# Altium schematic sheet Mechanical.SchDoc
size A3; SheetNumber: 14; SheetTotal: 15
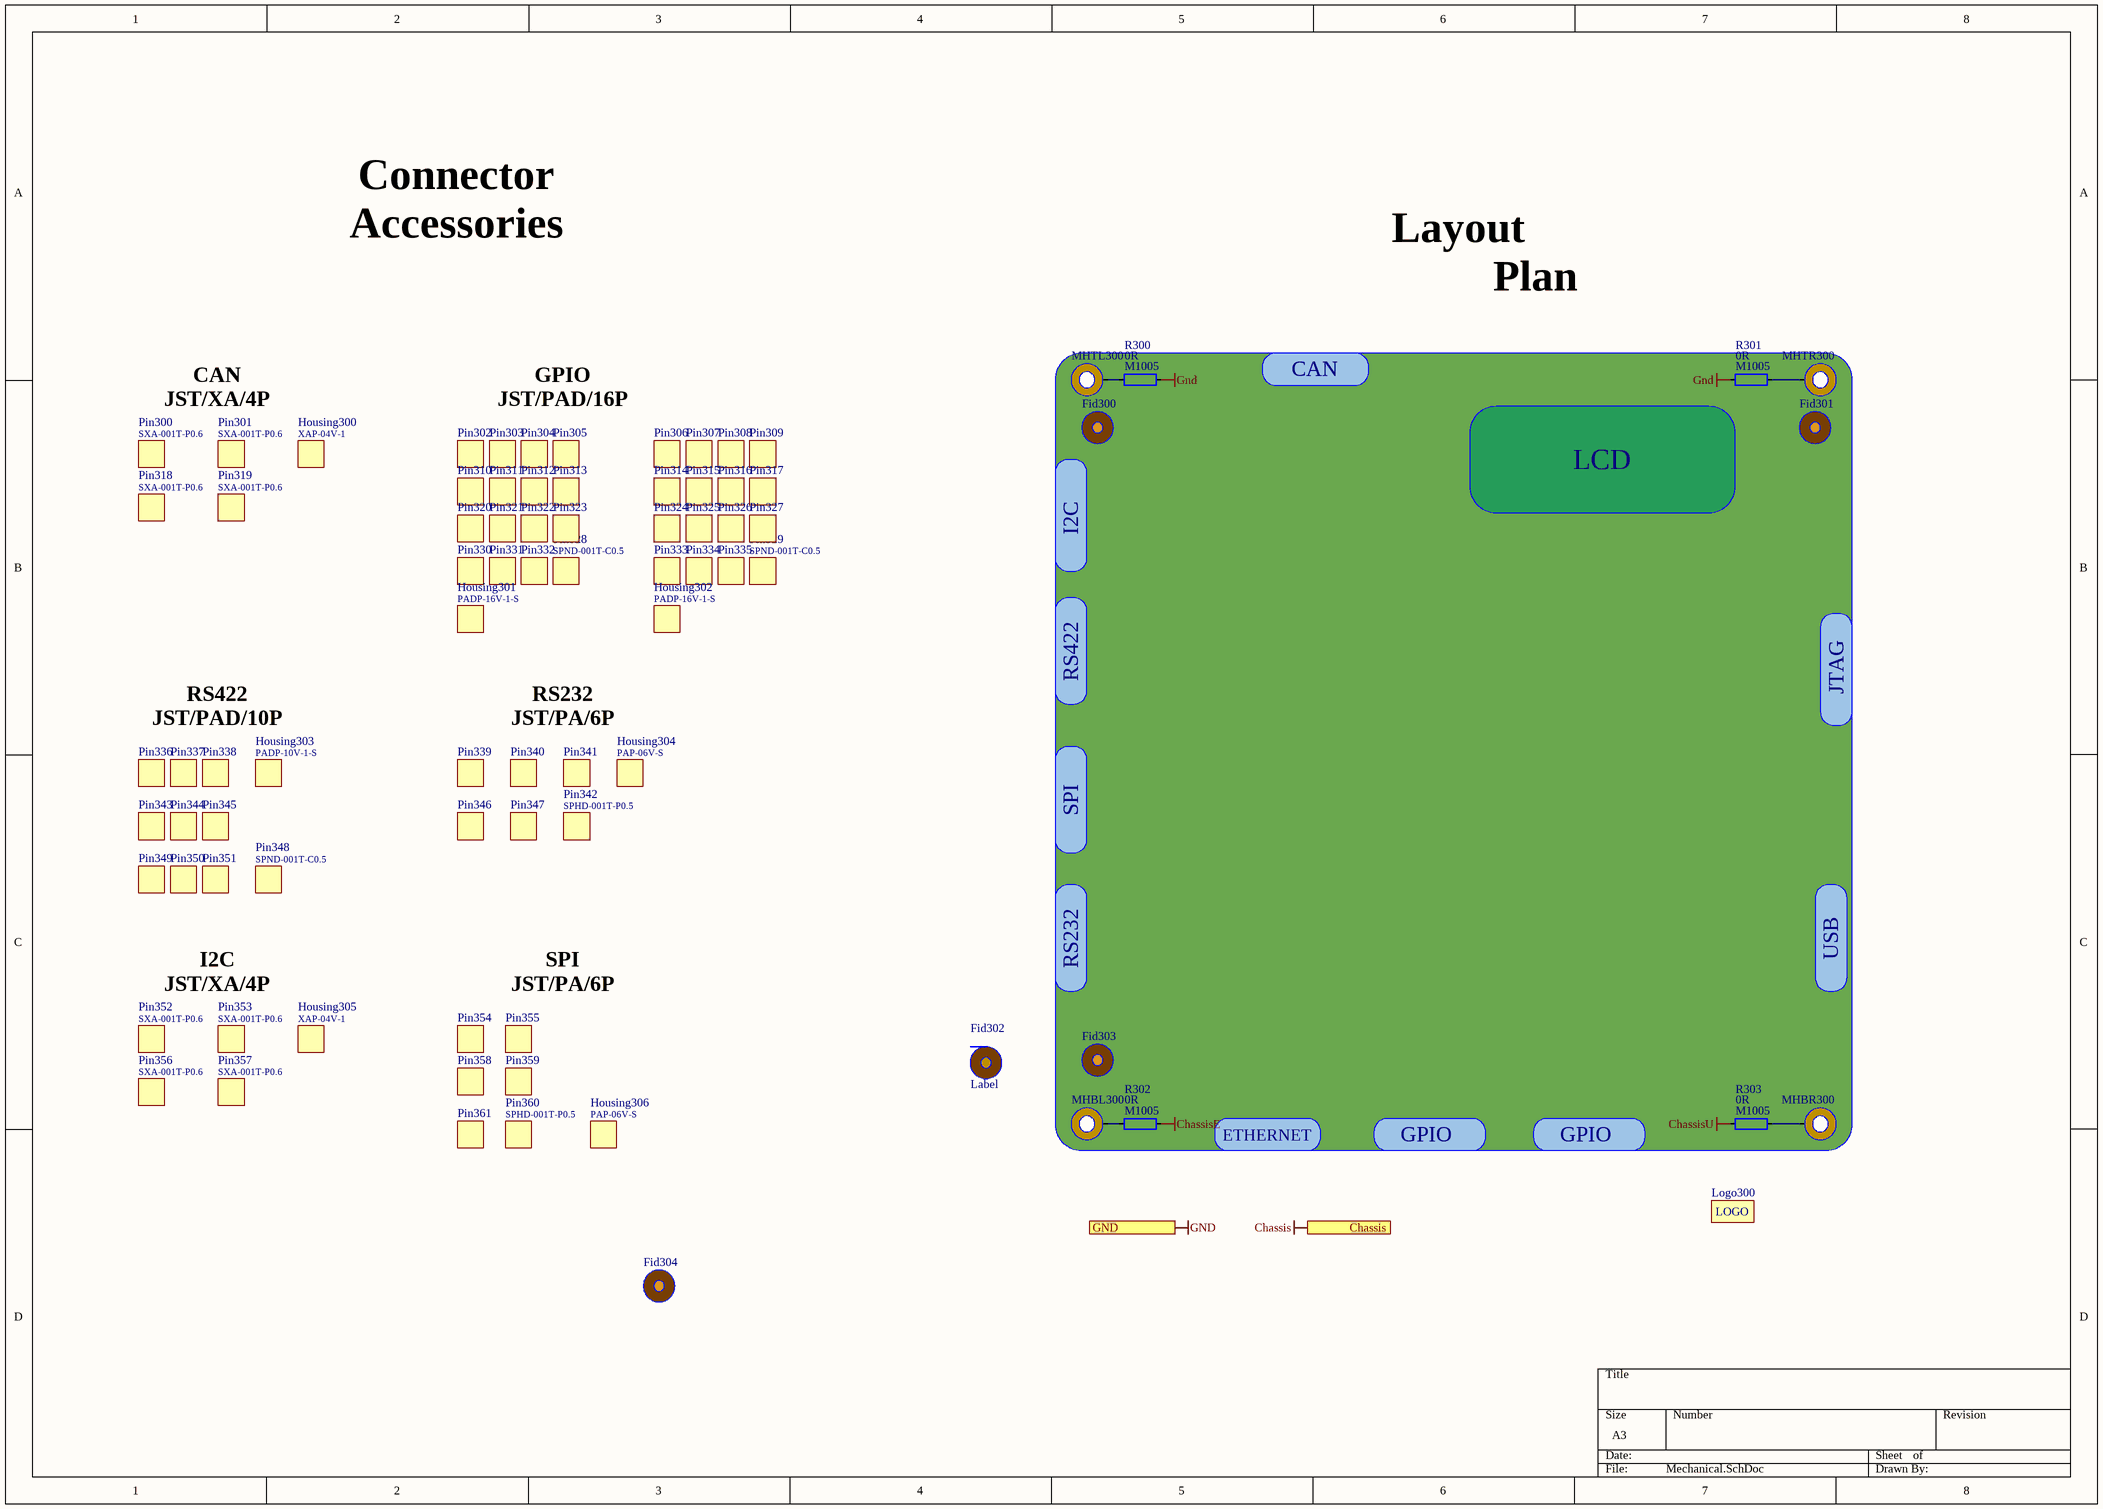
[diagram p0: Mechanical.SchDoc]

## Parts
Fid300  Fiducial  [Fiducial - 2mm, 5mm]  (value not drawn)  (no BOM)
Fid301  Fiducial  [Fiducial - 2mm, 5mm]  (value not drawn)  (no BOM)
Fid302  Fiducial  [Fiducial-2mm,5mm]  (value not drawn)
Fid303  Fiducial  [Fiducial - 2mm, 5mm]  (value not drawn)  (no BOM)
Fid304  Fiducial  [Fiducial - 2mm, 5mm]  (value not drawn)  (no BOM)
Housing300  Manufacturer Part Number: XAP-04V-1  [Housing, PAP-06V-S]  (hidden comment: Housing)
Housing301  Manufacturer Part Number: PADP-16V-1-S  [Housing, PADP-16V-1-S]  (hidden comment: Housing)
Housing302  Manufacturer Part Number: PADP-16V-1-S  [Housing, PADP-16V-1-S]  (hidden comment: Housing)
Housing303  Manufacturer Part Number: PADP-10V-1-S  [Housing, PADP-10V-1-S]  (hidden comment: Housing)
Housing304  Manufacturer Part Number: PAP-06V-S  [Housing, PAP-06V-S]  (hidden comment: Housing)
Housing305  Manufacturer Part Number: XAP-04V-1  [Housing, PAP-06V-S]  (hidden comment: Housing)
Housing306  Manufacturer Part Number: PAP-06V-S  [Housing, PAP-06V-S]  (hidden comment: Housing)
Logo300  Logo  [Logo 1]  (value not drawn)  (no BOM)
MHBL300  Mounting Hole  [Mounting Hole - Hole-3.2mm, Pad-5mm]  (value not drawn)  (no BOM)
MHBR300  Mounting Hole  [Mounting Hole - Hole-3.2mm, Pad-5mm]  (value not drawn)  (no BOM)
MHTL300  Mounting Hole  [Mounting Hole - Hole-3.2mm, Pad-5mm]  (value not drawn)  (no BOM)
MHTR300  Mounting Hole  [Mounting Hole - Hole-3.2mm, Pad-5mm]  (value not drawn)  (no BOM)
Pin300  Manufacturer Part Number: SXA-001T-P0.6  [Pin, SPHD-001T-P0.5]  (hidden comment: Pin)
Pin301  Manufacturer Part Number: SXA-001T-P0.6  [Pin, SPHD-001T-P0.5]  (hidden comment: Pin)
Pin302  Pin  [Pin, SPND-001T-C0.5]  (value not drawn)
Pin303  Pin  [Pin, SPND-001T-C0.5]  (value not drawn)
Pin304  Pin  [Pin, SPND-001T-C0.5]  (value not drawn)
Pin305  Pin  [Pin, SPND-001T-C0.5]  (value not drawn)
Pin306  Pin  [Pin, SPND-001T-C0.5]  (value not drawn)
Pin307  Pin  [Pin, SPND-001T-C0.5]  (value not drawn)
Pin308  Pin  [Pin, SPND-001T-C0.5]  (value not drawn)
Pin309  Pin  [Pin, SPND-001T-C0.5]  (value not drawn)
Pin310  Pin  [Pin, SPND-001T-C0.5]  (value not drawn)
Pin311  Pin  [Pin, SPND-001T-C0.5]  (value not drawn)
Pin312  Pin  [Pin, SPND-001T-C0.5]  (value not drawn)
Pin313  Pin  [Pin, SPND-001T-C0.5]  (value not drawn)
Pin314  Pin  [Pin, SPND-001T-C0.5]  (value not drawn)
Pin315  Pin  [Pin, SPND-001T-C0.5]  (value not drawn)
Pin316  Pin  [Pin, SPND-001T-C0.5]  (value not drawn)
Pin317  Pin  [Pin, SPND-001T-C0.5]  (value not drawn)
Pin318  Manufacturer Part Number: SXA-001T-P0.6  [Pin, SPHD-001T-P0.5]  (hidden comment: Pin)
Pin319  Manufacturer Part Number: SXA-001T-P0.6  [Pin, SPHD-001T-P0.5]  (hidden comment: Pin)
Pin320  Pin  [Pin, SPND-001T-C0.5]  (value not drawn)
Pin321  Pin  [Pin, SPND-001T-C0.5]  (value not drawn)
Pin322  Pin  [Pin, SPND-001T-C0.5]  (value not drawn)
Pin323  Pin  [Pin, SPND-001T-C0.5]  (value not drawn)
Pin324  Pin  [Pin, SPND-001T-C0.5]  (value not drawn)
Pin325  Pin  [Pin, SPND-001T-C0.5]  (value not drawn)
Pin326  Pin  [Pin, SPND-001T-C0.5]  (value not drawn)
Pin327  Pin  [Pin, SPND-001T-C0.5]  (value not drawn)
Pin328  Manufacturer Part Number: SPND-001T-C0.5  [Pin, SPND-001T-C0.5]  (hidden comment: Pin)
Pin329  Manufacturer Part Number: SPND-001T-C0.5  [Pin, SPND-001T-C0.5]  (hidden comment: Pin)
Pin330  Pin  [Pin, SPND-001T-C0.5]  (value not drawn)
Pin331  Pin  [Pin, SPND-001T-C0.5]  (value not drawn)
Pin332  Pin  [Pin, SPND-001T-C0.5]  (value not drawn)
Pin333  Pin  [Pin, SPND-001T-C0.5]  (value not drawn)
Pin334  Pin  [Pin, SPND-001T-C0.5]  (value not drawn)
Pin335  Pin  [Pin, SPND-001T-C0.5]  (value not drawn)
Pin336  Pin  [Pin, SPND-001T-C0.5]  (value not drawn)
Pin337  Pin  [Pin, SPND-001T-C0.5]  (value not drawn)
Pin338  Pin  [Pin, SPND-001T-C0.5]  (value not drawn)
Pin339  Pin  [Pin, SPHD-001T-P0.5]  (value not drawn)
Pin340  Pin  [Pin, SPHD-001T-P0.5]  (value not drawn)
Pin341  Pin  [Pin, SPHD-001T-P0.5]  (value not drawn)
Pin342  Manufacturer Part Number: SPHD-001T-P0.5  [Pin, SPHD-001T-P0.5]  (hidden comment: Pin)
Pin343  Pin  [Pin, SPND-001T-C0.5]  (value not drawn)
Pin344  Pin  [Pin, SPND-001T-C0.5]  (value not drawn)
Pin345  Pin  [Pin, SPND-001T-C0.5]  (value not drawn)
Pin346  Pin  [Pin, SPHD-001T-P0.5]  (value not drawn)
Pin347  Pin  [Pin, SPHD-001T-P0.5]  (value not drawn)
Pin348  Manufacturer Part Number: SPND-001T-C0.5  [Pin, SPND-001T-C0.5]  (hidden comment: Pin)
Pin349  Pin  [Pin, SPND-001T-C0.5]  (value not drawn)
Pin350  Pin  [Pin, SPND-001T-C0.5]  (value not drawn)
Pin351  Pin  [Pin, SPND-001T-C0.5]  (value not drawn)
Pin352  Manufacturer Part Number: SXA-001T-P0.6  [Pin, SPHD-001T-P0.5]  (hidden comment: Pin)
Pin353  Manufacturer Part Number: SXA-001T-P0.6  [Pin, SPHD-001T-P0.5]  (hidden comment: Pin)
Pin354  Pin  [Pin, SPHD-001T-P0.5]  (value not drawn)
Pin355  Pin  [Pin, SPHD-001T-P0.5]  (value not drawn)
Pin356  Manufacturer Part Number: SXA-001T-P0.6  [Pin, SPHD-001T-P0.5]  (hidden comment: Pin)
Pin357  Manufacturer Part Number: SXA-001T-P0.6  [Pin, SPHD-001T-P0.5]  (hidden comment: Pin)
Pin358  Pin  [Pin, SPHD-001T-P0.5]  (value not drawn)
Pin359  Pin  [Pin, SPHD-001T-P0.5]  (value not drawn)
Pin360  Manufacturer Part Number: SPHD-001T-P0.5  [Pin, SPHD-001T-P0.5]  (hidden comment: Pin)
Pin361  Pin  [Pin, SPHD-001T-P0.5]  (value not drawn)
R300  value 0R  Package: M1005  [Resistor_Smd_M1005_I0402]  (hidden comment: Resistor)
R301  value 0R  Package: M1005  [Resistor_Smd_M1005_I0402]  (hidden comment: Resistor)
R302  value 0R  Package: M1005  [Resistor_Smd_M1005_I0402]  (hidden comment: Resistor)
R303  value 0R  Package: M1005  [Resistor_Smd_M1005_I0402]  (hidden comment: Resistor)

## Blocks framed on the sheet
LCD: Fid300 Fid301 Fid303 MHBL300 MHBR300 MHTL300 MHTR300 R300-R303

## Ports
Chassis (out), GND (in)

## Nets
Chassis: port Chassis
ChassisE: R302.2
ChassisU: R303.1
GND: R300.2 R301.1 ; port GND
NetMHBL300_Hole: MHBL300.Hole R302.1
NetMHBR300_Hole: MHBR300.Hole R303.2
NetMHTL300_Hole: MHTL300.Hole R300.1
NetMHTR300_Hole: MHTR300.Hole R301.2

## Notes on the sheet
- Connector
  Accessories
- Layout
  Plan
- CAN
- CAN
  JST/XA/4P
- GPIO
  JST/PAD/16P
- I2C
- RS422
- JTAG
- RS422
  JST/PAD/10P
- RS232
  JST/PA/6P
- SPI
- RS232
- USB
- I2C
  JST/XA/4P
- SPI
  JST/PA/6P
- ETHERNET
- GPIO
- (in symbol Logo) LOGO

## Library data of the parts
Fid300 Fid301 Fid303 Fid304 = Fiducial: Mechanical, Fiducial, PCB, 2mm/5mm; Component Type: Fiducial; Component Category: Mechanical
Fid302 = Fiducial: IC,Interface,FTDI,QFN16; component category: capacitor*; ComponentLink1Description: datasheet; ComponentLink1URL: *; ComponentLink2Description: supplier link; ComponentLink2URL: *; component type: ceramic; supplier link: *; supplier currency: *; price,max: *; price,min: *; Quantity,max: *; Quantity,min: *; Operating Temparature,max: +85; Operating Temparature,min: -40; Supplier Part number: *; Supplier: Digikey; Manufacturer: FTDI; Package: Custom; Label: Label
Housing300 Housing305 = Housing: Housing, JST, 4P, XA; Component Category: Connector; ComponentLink1Description: Datasheet; ComponentLink1URL: E:\Altium\Datasheets\Connector - JST\XA Family.pdf; ComponentLink2Description: Supplier Link; ComponentLink2URL: https://www.digikey.com/en/products/detail/jst-sales-america-inc/XAP-04V-1/959010; Supplier: Digikey; Supplier Part Number: 455-2150-ND; Manufacturer: JST; Operating Temperature, Min: -25℃; Operating Temperature, Max: +85℃; Quantity, Min: 1; Quantity, Max: 2500; Price, Min: 0.16; Supplier Currency: $; Price, Max: 0.05958; Supplier Link: https://www.digikey.com/en/products/detail/jst-sales-america-inc/XAP-04V-1/959010; Component Type: Housing; Package: Housing
Housing301 Housing302 = Housing: Housing, JST, 16P, PAD; Component Category: Connector; ComponentLink1Description: Datasheet; ComponentLink1URL: E:\Altium\Datasheets\Connector - JST\PAD Family.pdf; ComponentLink2Description: Supplier Link; ComponentLink2URL: https://www.digikey.com/en/products/detail/jst-sales-america-inc/PADP-16V-1-S/1300224; Supplier: Digikey; Supplier Part Number: 455-2143-ND; Manufacturer: JST; Operating Temperature, Min: -25℃; Operating Temperature, Max: +85℃; Quantity, Min: 1; Quantity, Max: 2500; Price, Min: 0.35; Supplier Currency: $; Price, Max: 0.152; Supplier Link: https://www.digikey.com/en/products/detail/jst-sales-america-inc/PADP-16V-1-S/1300224?s=N4IgTCBcDaIAoEEAicC0BGAbANQyAugL5A; Component Type: PCB; Package: Housing
Housing303 = Housing: Housing, JST, 10P, PAD; Component Category: Connector; ComponentLink1Description: Datasheet; ComponentLink1URL: E:\Altium\Datasheets\Connector - JST\PAD Family.pdf; ComponentLink2Description: Supplier Link; ComponentLink2URL: https://www.digikey.com/en/products/detail/jst-sales-america-inc/PADP-10V-1-S/1300221; Supplier: Digikey; Supplier Part Number: 455-2140-ND; Manufacturer: JST; Operating Temperature, Min: -25℃; Operating Temperature, Max: +85℃; Quantity, Min: 1; Quantity, Max: 2500; Price, Min: 0.33; Supplier Currency: $; Price, Max: 0.14264; Supplier Link: https://www.digikey.com/en/products/detail/jst-sales-america-inc/PADP-10V-1-S/1300221; Component Type: PCB; Package: Housing
Housing304 = Housing: Housing, JST, PAP-06V-S; Component Category: Connector; ComponentLink1Description: Datasheet; ComponentLink1URL: E:\Altium\Datasheets\Connector - JST\PA Family.pdf; ComponentLink2Description: Supplier Link; ComponentLink2URL: https://www.digikey.com/en/products/detail/jst-sales-america-inc/PAP-06V-S/759978; Supplier: Digikey; Supplier Part Number: 455-1490-ND; Manufacturer: JST; Operating Temperature, Min: -25℃; Operating Temperature, Max: +85℃; Quantity, Min: 1; Quantity, Max: 2500; Price, Min: 0.19; Supplier Currency: $; Price, Max: 0.07808; Supplier Link: https://www.digikey.com/en/products/detail/jst-sales-america-inc/PAP-06V-S/759978; Component Type: PCB; Package: Housing
Housing306 = Housing: IC, Interface, FTDI, QFN-16; Manufacturer: JST; Component Category: Connector; ComponentLink1Description: Datasheet; ComponentLink1URL: E:\Altium\Datasheets\Connector - JST\PA Family.pdf; ComponentLink2Description: Supplier Link; ComponentLink2URL: https://www.digikey.com/en/products/detail/jst-sales-america-inc/PAP-06V-S/759978; Supplier: Digikey; Supplier Part Number: 455-1490-ND; Operating Temperature, Min: -25℃; Operating Temperature, Max: +85℃; Quantity, Min: 1; Quantity, Max: 2500; Price, Min: 0.19; Supplier Currency: $; Price, Max: 0.07808; Supplier Link: https://www.digikey.com/en/products/detail/jst-sales-america-inc/PAP-06V-S/759978; Component Type: PCB; Package: Housing
Logo300 = Logo: Mechanical, Logo; Component Type: Logo; Component Category: Mechanical
MHBL300 MHBR300 MHTL300 MHTR300 = Mounting Hole: Mechanical, Mounting Hole; Component Type: Mounting Hole; Component Category: Mechanical
Pin300 Pin301 Pin318 Pin319 Pin352 Pin353 Pin356 Pin357 = Pin: Pin, JST, SXA-001T-P0.6; Component Category: Connector; ComponentLink1Description: Datasheet; ComponentLink1URL: E:\Altium\Datasheets\Connector - JST\XA Family.pdf; ComponentLink2Description: Supplier Link; ComponentLink2URL: https://www.digikey.com/en/products/detail/jst-sales-america-inc/SXA-001T-P0-6/923775; Supplier: Digikey; Supplier Part Number: 455-1904-1-ND; Manufacturer: JST; Operating Temperature, Min: ---℃; Operating Temperature, Max: ---℃; Quantity, Min: 1; Quantity, Max: 56000; Price, Min: 0.1; Supplier Currency: $; Price, Max: 0.01303; Supplier Link: https://www.digikey.com/en/products/detail/jst-sales-america-inc/SXA-001T-P0-6/923775; Component Type: Pin; Package: Housing
Pin302-Pin317 Pin320-Pin338 Pin343-Pin345 Pin348-Pin351 = Pin: Pin, JST, SPND-001T-C0.5; Component Category: Connector; ComponentLink1Description: Datasheet; ComponentLink1URL: E:\Altium\Datasheets\Connector - JST\PAD Family.pdf; ComponentLink2Description: Supplier Link; ComponentLink2URL: https://www.digikey.com/en/products/detail/jst-sales-america-inc/SPND-001T-C0-5/1788519; Supplier: Digikey; Supplier Part Number: 455-2303-1-ND; Manufacturer: JST; Operating Temperature, Min: ---℃; Operating Temperature, Max: ---℃; Quantity, Min: 1; Quantity, Max: 56000; Price, Min: 0.1; Supplier Currency: $; Price, Max: 0.01409; Supplier Link: https://www.digikey.com/en/products/detail/jst-sales-america-inc/SPND-001T-C0-5/1788519; Component Type: PCB; Package: Housing
  Pin302-Pin317 Pin320-Pin327 Pin330-Pin338 Pin343-Pin345 Pin349-Pin351: Manufacturer Part Number: SPND-001T-C0.5
Pin339-Pin342 Pin346 Pin347 = Pin: Pin, JST, SPHD-001T-P0.5; Component Category: Connector; ComponentLink1Description: Datasheet; ComponentLink1URL: E:\Altium\Datasheets\Connector - JST\PA Family.pdf; ComponentLink2Description: Supplier Link; ComponentLink2URL: https://www.digikey.com/en/products/detail/jst-sales-america-inc/SPHD-001T-P0-5/608766; Supplier: Digikey; Supplier Part Number: 455-1325-1-ND; Manufacturer: JST; Operating Temperature, Min: *℃; Operating Temperature, Max: *℃; Quantity, Min: 1; Quantity, Max: 2500; Price, Min: 0.1; Supplier Currency: $; Price, Max: 0.01478; Supplier Link: https://www.digikey.com/en/products/detail/jst-sales-america-inc/SPHD-001T-P0-5/608766; Component Type: PCB; Package: Housing
  Pin339-Pin341 Pin346 Pin347: Manufacturer Part Number: SPHD-001T-P0.5
Pin354 Pin355 Pin358 Pin359 Pin361 = Pin: IC, Interface, FTDI, QFN-16; Manufacturer: JST; Manufacturer Part Number: SPHD-001T-P0.5; Component Category: Connector; ComponentLink1Description: Datasheet; ComponentLink1URL: E:\Altium\Datasheets\Connector - JST\PA Family.pdf; ComponentLink2Description: Supplier Link; ComponentLink2URL: https://www.digikey.com/en/products/detail/jst-sales-america-inc/SPHD-001T-P0-5/608766; Supplier: Digikey; Supplier Part Number: 455-1325-1-ND; Operating Temperature, Min: *℃; Operating Temperature, Max: *℃; Quantity, Min: 1; Quantity, Max: 2500; Price, Min: 0.1; Supplier Currency: $; Price, Max: 0.01478; Supplier Link: https://www.digikey.com/en/products/detail/jst-sales-america-inc/SPHD-001T-P0-5/608766; Component Type: PCB; Package: Housing
Pin360 = Pin: IC, Interface, FTDI, QFN-16; Manufacturer: JST; Component Category: Connector; ComponentLink1Description: Datasheet; ComponentLink1URL: E:\Altium\Datasheets\Connector - JST\PA Family.pdf; ComponentLink2Description: Supplier Link; ComponentLink2URL: https://www.digikey.com/en/products/detail/jst-sales-america-inc/SPHD-001T-P0-5/608766; Supplier: Digikey; Supplier Part Number: 455-1325-1-ND; Operating Temperature, Min: *℃; Operating Temperature, Max: *℃; Quantity, Min: 1; Quantity, Max: 2500; Price, Min: 0.1; Supplier Currency: $; Price, Max: 0.01478; Supplier Link: https://www.digikey.com/en/products/detail/jst-sales-america-inc/SPHD-001T-P0-5/608766; Component Type: PCB; Package: Housing
R300-R303 = Resistor: Res, 0R, M1005; Manufacturer: Yageo; Manufacturer Part Number: RC0402FR-070RL; Component Category: Resistor; Component Type: Fixed Value; Tolerance: *; Supplier Link: https://www.digikey.com/en/products/detail/yageo/RC0402FR-070RL/2827570; Supplier Currency: $; Price, Max: 0.00109; Price, Min: 0.1; Quantity, Max: 50000; Quantity, Min: 1; Operating Temperature, Max: -55℃; Operating Temperature, Min: +155℃; Supplier Part Number: 311-0.0LRCT-ND; Supplier: Digikey; ComponentLink1Description: Datasheet; ComponentLink1URL: E:\Altium\Datasheets\Resistor\Yageo - RC_L Series.pdf; ComponentLink2Description: Supplier Link; ComponentLink2URL: https://www.digikey.com/en/products/detail/yageo/RC0402FR-070RL/2827570